# EAGLE design tester (EAGLE 9.3.0)
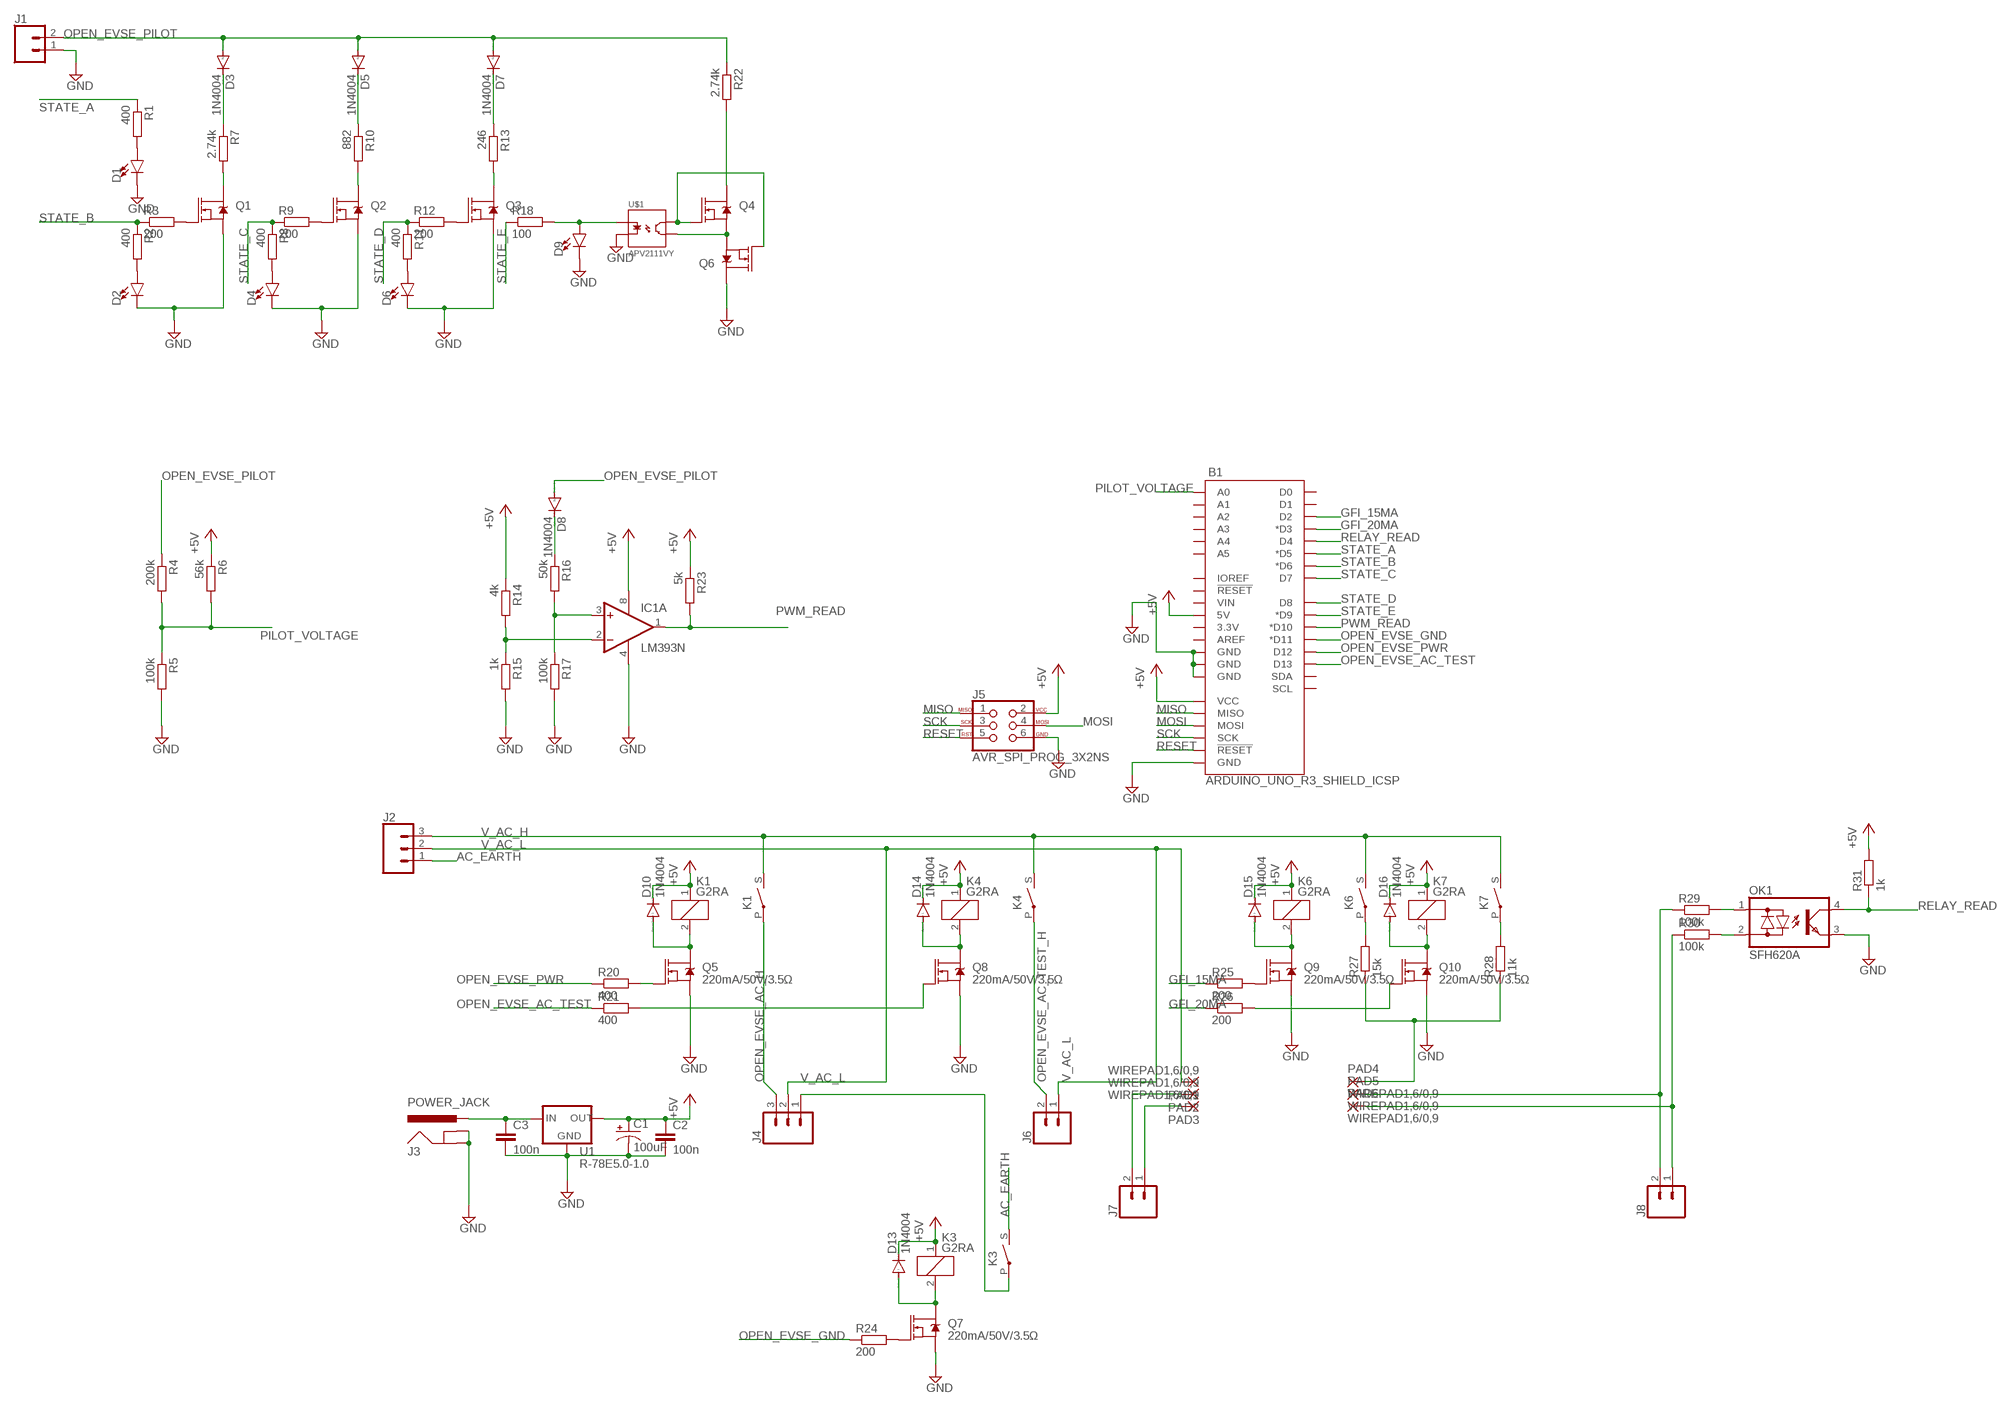
[diagram p0: schematic, sheet 1]

## Parts
B1  ARDUINO_UNO_R3_SHIELD_ICSP  [UNO_R3_SHIELD_ICSP]
C1  100uF  100UF-POLAR-RADIAL-2.5MM-25V-20%  [CPOL-RADIAL-2.5MM-6.5MM]
C2  100n  C-EU025-024X044  [C025-024X044]
C3  100n  C-EU025-024X044  [C025-024X044]
D1  LED-FKIT-1206  [FKIT-LED-1206]
D2  LED-FKIT-1206  [FKIT-LED-1206]
D3  1N4004  [DO41-10]
D4  LED-FKIT-1206  [FKIT-LED-1206]
D5  1N4004  [DO41-10]
D6  LED-FKIT-1206  [FKIT-LED-1206]
D7  1N4004  [DO41-10]
D8  1N4004  [DO41-10]
D9  LED-FKIT-1206  [FKIT-LED-1206]
D10  1N4004  [DO41-10]
D13  1N4004  [DO41-10]
D14  1N4004  [DO41-10]
D15  1N4004  [DO41-10]
D16  1N4004  [DO41-10]
IC1  LM393N  [DIL08]
J1  CONN_023.5MM  [SCREWTERMINAL-3.5MM-2]
J2  CONN_03-SCREW-5MM  [SCREWTERMINAL-5MM-3]
J3  POWER_JACK  [POWER_JACK_PTH]
J4  CONN_03-SCREW-5MM  [SCREWTERMINAL-5MM-3]
J5  AVR_SPI_PROG_3X2NS  [2X3-NS]
J6  CONN_023.5MM  [SCREWTERMINAL-3.5MM-2]
J7  CONN_023.5MM  [SCREWTERMINAL-3.5MM-2]
J8  CONN_023.5MM  [SCREWTERMINAL-3.5MM-2]
K1  G2RA  [G2RA]
K3  G2RA  [G2RA]
K4  G2RA  [G2RA]
K6  G2RA  [G2RA]
K7  G2RA  [G2RA]
OK1  SFH620A  [DIL04]
PAD1  WIREPAD1,6/0,9  [1,6/0,9]
PAD2  WIREPAD1,6/0,9  [1,6/0,9]
PAD3  WIREPAD1,6/0,9  [1,6/0,9]
PAD4  WIREPAD1,6/0,9  [1,6/0,9]
PAD5  WIREPAD1,6/0,9  [1,6/0,9]
PAD6  WIREPAD1,6/0,9  [1,6/0,9]
Q1  220mA/50V/3.5Ω  MOSFET-NCH-BSS138  [SOT23-3]
Q2  220mA/50V/3.5Ω  MOSFET-NCH-BSS138  [SOT23-3]
Q3  220mA/50V/3.5Ω  MOSFET-NCH-BSS138  [SOT23-3]
Q4  220mA/50V/3.5Ω  MOSFET-NCH-BSS138  [SOT23-3]
Q5  220mA/50V/3.5Ω  MOSFET-NCH-BSS138  [SOT23-3]
Q6  220mA/50V/3.5Ω  MOSFET-NCH-BSS138  [SOT23-3]
Q7  220mA/50V/3.5Ω  MOSFET-NCH-BSS138  [SOT23-3]
Q8  220mA/50V/3.5Ω  MOSFET-NCH-BSS138  [SOT23-3]
Q9  220mA/50V/3.5Ω  MOSFET-NCH-BSS138  [SOT23-3]
Q10  220mA/50V/3.5Ω  MOSFET-NCH-BSS138  [SOT23-3]
R1  400  R-EU_R1206  [R1206]
R2  400  R-EU_R1206  [R1206]
R3  200  R-EU_R1206  [R1206]
R4  200k  R-EU_R1206  [R1206]
R5  100k  R-EU_R1206  [R1206]
R6  56k  R-EU_R1206  [R1206]
R7  2.74k  R-EU_R1206  [R1206]
R8  400  R-EU_R1206  [R1206]
R9  200  R-EU_R1206  [R1206]
R10  882  R-EU_R1206  [R1206]
R11  400  R-EU_R1206  [R1206]
R12  200  R-EU_R1206  [R1206]
R13  246  R-EU_R1206  [R1206]
R14  4k  R-EU_R1206  [R1206]
R15  1k  R-EU_R1206  [R1206]
R16  50k  R-EU_R1206  [R1206]
R17  100k  R-EU_R1206  [R1206]
R18  100  R-EU_R1206  [R1206]
R20  400  R-EU_R1206  [R1206]
R21  400  R-EU_R1206  [R1206]
R22  2.74k  R-EU_R1206  [R1206]
R23  5k  R-EU_R1206  [R1206]
R24  200  R-EU_R1206  [R1206]
R25  200  R-EU_R1206  [R1206]
R26  200  R-EU_R1206  [R1206]
R27  15k  R-EU_0204/5  [0204/5]
R28  11k  R-EU_0204/5  [0204/5]
R29  100k  R-EU_0204/5  [0204/5]
R30  100k  R-EU_0204/5  [0204/5]
R31  1k  R-EU_R1206  [R1206]
U1  R-78E5.0-1.0  [DC-DC_CONVERTER_78XX]
U$1  APV2111VY  [SSOP4]

## Nets
+5V: B1.5V B1.5V_ICSP(VCC) C1.1(+) C2.1 D10.C D13.C D14.C D15.C D16.C IC1.8(P:V+) J5.2 K1.1 K3.1 K4.1 K6.1 K7.1 R6.1 R14.1 R23.1 R31.2 U1.VOUT(OUT)
AC_EARTH [230v]: J2.1 K3.S(2:S)
GFI_15MA: B1.D2 R25.1
GFI_20MA: B1.D3(*D3) R26.1
GND: B1.GND@0(GND) B1.GND@1(GND) B1.GND@2(GND) B1.GND_ICSP(GND) C1.2(-) C2.2 C3.2 D1.C D2.C D4.C D6.C D9.C IC1.4(P:V-) J1.1 J3.GND J3.GNDBREAK J5.6 OK1.3(E) Q1.2(S) Q2.2(S) Q3.2(S) Q5.2(S) Q6.3(D) Q7.2(S) Q8.2(S) Q9.2(S) Q10.2(S) R5.2 R15.2 R17.2 U1.GND U$1.2(C1)
MISO: B1.MISO J5.1
MOSI: B1.MOSI J5.4
N$1: Q1.1(G) R3.2
N$2: D2.A R2.2
N$3: D3.C R7.1
N$4: Q2.1(G) R9.2
N$5: D6.A R11.2
N$6: Q3.1(G) R12.2
N$7: D7.C R13.1
N$8: Q3.3(D) R13.2
N$9 [230v]: J7.1 PAD3.1(P)
N$10: IC1.2(A:-IN) R14.2 R15.1
N$11: Q1.3(D) R7.2
N$12: IC1.3(A:+IN) R16.2 R17.1
N$13: D8.C R16.1
N$14: Q4.2(S) Q6.2(S) U$1.4(EM1)
N$15 [230v]: J7.2 PAD2.1(P)
N$16: Q4.3(D) R22.2
N$17 [230v]: J4.1 K3.P(2:P)
N$18 [230v]: J8.2 PAD5.1(P) R29.1
N$19 [230v]: J8.1 PAD6.1(P) R30.1
N$20 [230v]: OK1.1(AC1) R29.2
N$21 [230v]: OK1.2(AC2) R30.2
N$22: C3.1 J3.PWR U1.VIN(IN)
N$23: D15.A K6.2 Q9.3(D)
N$24: D4.A R8.2
N$25: D16.A K7.2 Q10.3(D)
N$26: K7.P(2:P) R28.2
N$27: Q8.1(G) R21.2
N$28 [230v]: K6.P(2:P) R27.2
N$29 [230v]: PAD4.1(P) R27.1 R28.1
N$30: D14.A K4.2 Q8.3(D)
N$31: Q2.3(D) R10.2
N$32: D10.A K1.2 Q5.3(D)
N$33: Q5.1(G) R20.2
N$34: D5.C R10.1
N$35: Q9.1(G) R25.2
N$36: Q10.1(G) R26.2
N$37: D1.A R1.2
N$38: D9.A R18.2 U$1.1(A1)
N$39: Q7.1(G) R24.2
N$40: D13.A K3.2 Q7.3(D)
N$43: Q4.1(G) Q6.1(G) U$1.3(CL1)
OPEN_EVSE_AC_H [230v]: J4.3 K1.P(2:P)
OPEN_EVSE_AC_TEST: B1.D13 R21.1
OPEN_EVSE_AC_TEST_H [230v]: J6.2 K4.P(2:P)
OPEN_EVSE_GND: B1.D11(*D11) R24.1
OPEN_EVSE_PILOT: D3.A D5.A D7.A D8.A J1.2 R4.1 R22.1
OPEN_EVSE_PWR: B1.D12 R20.1
PILOT_VOLTAGE: B1.A0 R4.2 R5.1 R6.2
PWM_READ: B1.D10(*D10) IC1.1(A:OUT) R23.2
RELAY_READ: B1.D4 OK1.4(C) R31.1
RESET: B1.RST_ICSP(!RESET!) J5.5
SCK: B1.SCK J5.3
STATE_A: B1.D5(*D5) R1.1
STATE_B: B1.D6(*D6) R2.1 R3.1
STATE_C: B1.D7 R8.1 R9.1
STATE_D: B1.D8 R11.1 R12.1
STATE_E: B1.D9(*D9) R18.1
V_AC_H [230v]: J2.3 K1.S(2:S) K4.S(2:S) K6.S(2:S) K7.S(2:S)
V_AC_L [230v]: J2.2 J4.2 J6.1 PAD1.1(P)
Unconnected: B1.3.3V B1.A1 B1.A2 B1.A3 B1.A4 B1.A5 B1.AREF B1.IOREF B1.RES(!RESET!) B1.RX(D0) B1.SCL B1.SDA B1.TX(D1) B1.VIN IC1.5(B:+IN) IC1.6(B:-IN) IC1.7(B:OUT)

## Library data of the parts
B1 = SparkFun-Boards:ARDUINO_UNO_R3_SHIELD_ICSP: Arduino R3 Shield Footprint with ICSP Header Includes pins for 6-pin (2x3) ICSP Header. Compatible with Leonardo boards that require SPI pin connections via this header. SparkFun Products: CryptoShield <https://www.sparkfun.com/products/13183> microSD Shield <https://www.sparkfun.com/products/12761> R3 Stackable Headers Kit <https://www.sparkfun.com/products/1417>
C1 = SparkFun-Capacitors:100UF-POLAR: 100µF polarized capacitors A capacitor is a passive two-terminal electrical component used to store electrical energy temporarily in an electric field.; PROD_ID: CAP-08439
C2 C3 = rcl:C-EU: CAPACITOR, European symbol; SPICEPREFIX: C
D1 D2 D4 D6 D9 = SparkFun-LED:LED: LED (Generic) Standard schematic elements and footprints for 5mm, 3mm, 1206, and 0603 sized LEDs. Generic LEDs with no color specified.
D3 D5 D7 D8 D10 D13-D16 = diode:1N4004: DIODE general purpose rectifier, 1 A
IC1 = linear:LM393: COMPARATOR
J1 J6-J8 = SparkFun-Connectors:CONN_02: Multi connection point. Often used as Generic Header-pin footprint for 0.1 inch spaced/style header connections On any of the 0.1 inch spaced packages, you can populate with these: Break Away Headers - Straight <https://www.sparkfun.com/products/116> (PRT-00116) Break Away Male Headers - Right Angle <https://www.sparkfun.com/products/553> (PRT-00553) Female Headers <https://www.sparkfun.com/products/115> (PRT-00115) Break Away Headers - Machine Pin <https://www.sparkfun.com/products/117> (PRT-00117) Break Away Female Headers - Swiss Machine Pin <https://www.sparkfun.com/products/743> (PRT-00743) For SCREWTERMINALS and SPRING TERMINALS visit here: Screw Terimnals on SparkFun.com <https://www.sparkfun.com/search/results?term=Screw+Terminals> (5mm/3.5mm/2.54mm spacing) This device is also useful as a general connection point to wire up your design to another part of your project. Our various solder wires solder well into these plated through hole pads. Hook-Up Wire - Assortment (Stranded, 22 AWG) <https://www.sparkfun.com/products/11375> (PRT-11375) Hook-Up Wire - Assortment (Solid Core, 22 AWG) <https://www.sparkfun.com/products/11367> (PRT-11367) View the entire wire category on our website here <https://www.sparkfun.com/categories/141> Special notes: Molex polarized connector foot print use with: PRT-08233 with associated crimp pins and housings. 2.54_SCREWTERM for use with PRT-10571. 3.5mm Screw Terminal footprints for PRT-08084 5mm Screw Terminal footprints for use with PRT-08432; PROD_ID: CONN-08399
J2 J4 = SparkFun-Connectors:CONN_03: Multi connection point. Often used as Generic Header-pin footprint for 0.1 inch spaced/style header connections On any of the 0.1 inch spaced packages, you can populate with these: Break Away Headers - Straight <https://www.sparkfun.com/products/116> (PRT-00116) Break Away Male Headers - Right Angle <https://www.sparkfun.com/products/553> (PRT-00553) Female Headers <https://www.sparkfun.com/products/115> (PRT-00115) Break Away Headers - Machine Pin <https://www.sparkfun.com/products/117> (PRT-00117) Break Away Female Headers - Swiss Machine Pin <https://www.sparkfun.com/products/743> (PRT-00743) Stackable Header - 3 Pin (Female, 0.1") <https://www.sparkfun.com/products/13875> (PRT-13875) For SCREWTERMINALS and SPRING TERMINALS visit here: Screw Terimnals on SparkFun.com <https://www.sparkfun.com/search/results?term=Screw+Terminals> (5mm/3.5mm/2.54mm spacing) This device is also useful as a general connection point to wire up your design to another part of your project. Our various solder wires solder well into these plated through hole pads. Hook-Up Wire - Assortment (Stranded, 22 AWG) <https://www.sparkfun.com/products/11375> (PRT-11375) Hook-Up Wire - Assortment (Solid Core, 22 AWG) <https://www.sparkfun.com/products/11367> (PRT-11367) View the entire wire category on our website here <https://www.sparkfun.com/categories/141> Special notes: Molex polarized connector foot print use with SKU : PRT-08232 with associated crimp pins and housings.; PROD_ID: CONN-10134; SF_SKU: PRT-08433
J3 = SparkFun-Connectors:POWER_JACK: Power Jack Connector This is the standard 5.5mm barrel jack for power. The PTH is the most common, proven, reliable, footprint. The Slot footprint only works if the mill layer is transmitted to the PCB fab house so be warned. Here are the connectors we sell at SparkFun: DC Barrel Power Jack/Connector <https://www.sparkfun.com/products/119> (PRT-00119) DC Barrel Power Jack/Connector (SMD) <https://www.sparkfun.com/products/12748> (PRT-12748) DC Barrel Jack Adapter - Breadboard Compatible <https://www.sparkfun.com/products/10811> (PRT-10811) It is used on this SparkFun product (and many, many others): SparkFun RedBoard - Programmed with Arduino <https://www.sparkfun.com/products/12757> (DEV-12757) Also, if you need a mating power supply or connector, please check these out: Wall Adapter Power Supply - 9VDC 650mA <https://www.sparkfun.com/products/298> (TOL-00298) DC Barrel Jack Adapter - Male <https://www.sparkfun.com/products/10287> (PRT-10287); PROD_ID: CONN-08197
J5 = SparkFun-Connectors:AVR_SPI_PROG_3X2: AVR ISP 6 Pin This is the reduced ISP connector for AVR programming. Common on Arduino. This footprint will take up less PCB space and can be used with a 10-pin to 6-pin adapter such as SKU: BOB-08508 **Special note about "TEST_POINT" package. The stop mask is on the top side, so if you want your programming test points to be on the bottom of your board, make sure to place this package on the bottom side of the board. This also ensure that the orientation to program from the bottom side will be correct. SparkFun Products: SparkFun ISP Pogo Adapter <https://www.sparkfun.com/products/11591> - NS Tiny AVR Programmer <https://www.sparkfun.com/products/11801> -PTH
K1 K3 K4 K6 K7 = relay:G2RA: RELAY 1 x norm. open, Omron; OC_FARNELL: unknown; OC_NEWARK: unknown
OK1 = optocoupler:SFH620: Optocoupler, Phototransistor Output, AC Input Source: http://www.vishay.com/docs/83675/sfh620.pdf; MPN: SFH620A-2; OC_FARNELL: 1469594; OC_NEWARK: 97K9546
PAD1-PAD6 = wirepad:WIREPAD: Wire PAD connect wire on PCB
Q1-Q10 = SparkFun-DiscreteSemi:MOSFET-NCH: N-channel MOSFETs Voltage controlled devices that allow control of high current outputs. SparkFun Products: SparkFun OpenScale <https://www.sparkfun.com/products/13261> SparkFun Digital Sandbox <https://www.sparkfun.com/products/12651> SparkFun Monster Moto Shield <https://www.sparkfun.com/products/10182> SparkFun MOSFET Power Controller <https://www.sparkfun.com/products/11214>; PROD_ID: TRANS-00830
R1-R18 R20-R31 = rcl:R-EU_: RESISTOR, European symbol; SPICEPREFIX: R
U1 = SparkFun-IC-Power:R-78E5.0-1.0: Recom Power 5V 1A DC/DC Converter The Recom R-78E5.0-X.X is a compact DC/DC converter module that is a pin for pin drop-in replacement for the LM7805 linear voltage regulator. Specifications: Input Range: 7-28V Output Voltage: 5V Output Current: 1A Max Efficiency: 91% Datasheet <https://www.recom-power.com/pdf/Innoline/R-78Exx-1.0.pdf>; PROD_ID: COM-13655
U$1 = parts:APV2111VY

## Net classes
0 default: width 0.254 mm, drill 0.305 mm, clearance 0.203 mm
1 230v: width 0.61 mm, drill 0.711 mm, clearance 0.813 mm

## Board
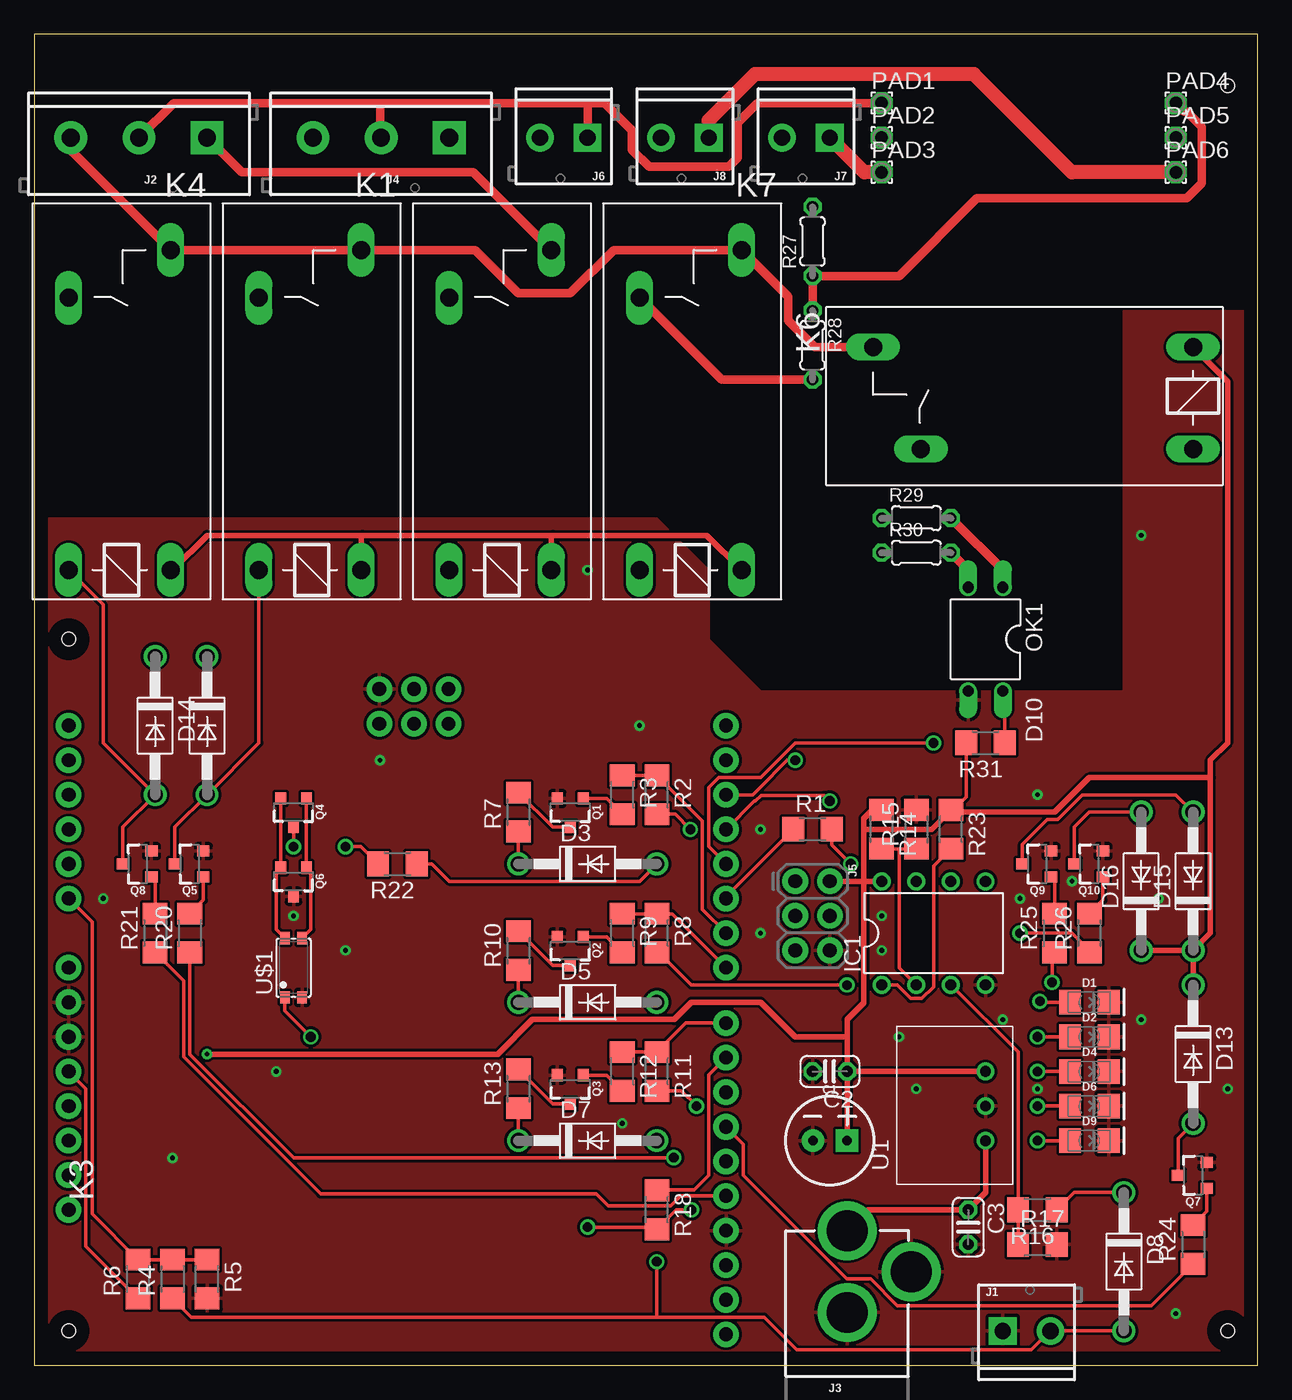
[diagram p1: board, top side]
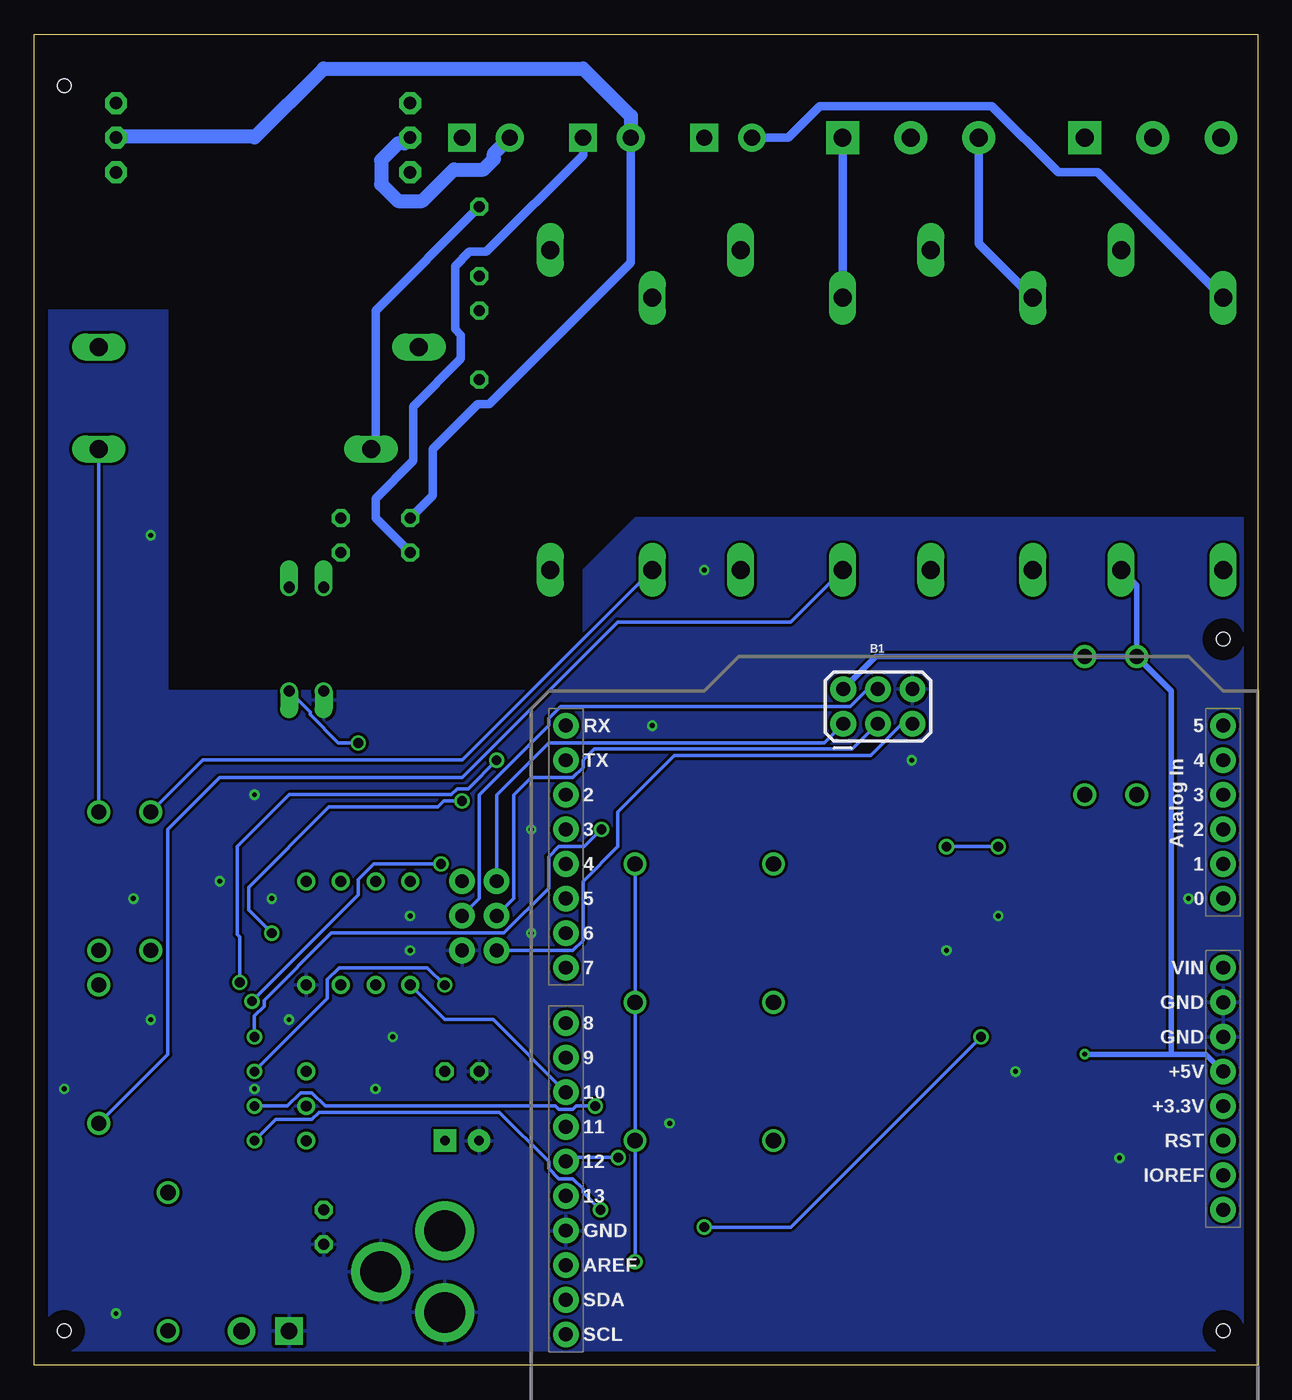
[diagram p2: board, bottom side, seen from below]

Size 89.84 x 97.78 mm. Coordinates in mm from the lower left corner, seen from the top.
Outline: 0,0 89.84,0 89.84,97.78 0,97.78 0,0
Copper layers (1*16): Top 0.035mm / dielectric 1.5mm / Bottom 0.035mm
Design rules "default": minimum track width 6mil, minimum drill 0.35mm, track to track 6mil, track to pad 6mil, pad to pad 6mil, via to via 6mil, smd to smd 6mil, copper to edge 40mil, drill to drill 6mil, minimum pad ring 10mil, minimum via ring 8mil, stop-mask expansion 4mil, vias tented up to drill 0mil, thermal gap 10mil
Holes 1 mm at 87.63,93.98 87.63,2.54 2.54,2.54 2.54,53.34

### Footprints (pad centres in the part's own frame; a part is rotated, then mirrored left to right if it is on the bottom)
UNO_R3_SHIELD_ICSP = drill 1.016 pad 1.88: 3.3V 24.13,-3.81; 5V 24.13,-1.27; 5V_ICSP -3.76,26.81; A0 24.13,11.43; A1 24.13,13.97; A2 24.13,16.51; A3 24.13,19.05; A4 24.13,21.59; A5 24.13,24.13; AREF -24.13,-15.494; D2 -24.13,19.05; D3 -24.13,16.51; D4 -24.13,13.97; D5 -24.13,11.43; D6 -24.13,8.89; D7 -24.13,6.35; D8 -24.13,2.286; D9 -24.13,-0.254; D10 -24.13,-2.794; D11 -24.13,-5.334; D12 -24.13,-7.874; D13 -24.13,-10.414; GND@0 24.13,1.27; GND@1 24.13,3.81; GND@2 -24.13,-12.954; GND_ICSP 1.32,26.81; IOREF 24.13,-8.89; MISO -3.76,24.27; MOSI -1.22,26.81; NC 24.13,-11.43; RES 24.13,-6.35; RST_ICSP 1.32,24.27; RX -24.13,24.13; SCK -1.22,24.27; SCL -24.13,-20.574; SDA -24.13,-18.034; TX -24.13,21.59; VIN 24.13,6.35
CPOL-RADIAL-2.5MM-6.5MM = drill 0.7 pad 1.651 square: 1 1.25,0 | drill 0.7 pad 1.651: 2 -1.25,0
C025-024X044 = drill 0.813 octagon: 1 -1.27,0; 2 1.27,0
FKIT-LED-1206 = smd 1.6 x 1.803: A -1.422,0; C 1.422,0
DO41-10 = drill 1.118: A 5.08,0; C -5.08,0
DIL08 = drill 0.813 pad 1.27: 1 -3.81,-3.81; 2 -1.27,-3.81; 3 1.27,-3.81; 4 3.81,-3.81; 5 3.81,3.81; 6 1.27,3.81; 7 -1.27,3.81; 8 -3.81,3.81
SCREWTERMINAL-3.5MM-2 = drill 1.2 pad 2.032 square: 1 0,0 | drill 1.2 pad 2.032: 2 3.5,0
SCREWTERMINAL-5MM-3 = drill 1.3 pad 2.413 square: 1 0,0 | drill 1.3 pad 2.413: 2 5,0; 3 10,0
POWER_JACK_PTH = drill 2.997 pad 4.318: GND 0,7.7; GNDBREAK 4.7,10.7; PWR 0,13.7
2X3-NS = drill 1.016 pad 1.88: 1 -2.54,-1.27; 2 -2.54,1.27; 3 0,-1.27; 4 0,1.27; 5 2.54,-1.27; 6 2.54,1.27
G2RA = drill 1.321 long: 1 -3.81,-3.683; 2 -3.81,3.81; P 16.18,3.81; S 19.685,-3.683
DIL04 = drill 0.813 offset: 1 -1.27,-3.81; 2 1.27,-3.81; 3 1.27,3.81; 4 -1.27,3.81
1,6/0,9 = drill 0.914 pad 1.6 octagon: 1 0,0
SOT23-3 = smd 0.8 x 0.9: 1 -0.95,-1; 2 0.95,-1; 3 0,1.1
R1206 = smd 1.6 x 1.803: 1 -1.422,0; 2 1.422,0
0204/5 = drill 0.813 octagon: 1 -2.54,0; 2 2.54,0
DC-DC_CONVERTER_78XX = drill 0.8: GND 0,0; VIN -2.54,0; VOUT 2.54,0
SSOP4 = smd 0.9 x 0.7: 1 -2.175,0.635; 2 -2.175,-0.635; 3 2.175,-0.635; 4 2.175,0.635

### Placement (x,y rotation side)
B1  26.67,22.86 0 bottom
C1  58.42,16.51 0 top
C2  58.42,21.59 180 top
C3  68.58,10.16 270 top
D1  77.47,26.67 0 top
D2  77.47,24.13 0 top
D3  40.64,36.83 0 top
D4  77.47,21.59 0 top
D5  40.64,26.67 0 top
D6  77.47,19.05 0 top
D7  40.64,16.51 0 top
D8  80.01,7.62 270 top
D9  77.47,16.51 0 top
D10  12.7,46.99 270 top
D13  85.09,22.86 270 top
D14  8.89,46.99 270 top
D15  85.09,35.56 90 top
D16  81.28,35.56 90 top
IC1  66.04,31.75 0 top
J1  71.12,2.54 0 top
J2  12.7,90.17 180 top
J3  59.69,-3.81 0 top
J4  30.48,90.17 180 top
J5  57.15,33.02 270 top
J6  40.64,90.17 180 top
J7  58.42,90.17 180 top
J8  49.53,90.17 180 top
K1  20.32,62.23 90 top
K3  34.29,62.23 90 top
K4  6.35,62.23 90 top
K6  81.28,71.12 180 top
K7  48.26,62.23 90 top
OK1  69.85,53.34 180 top
PAD1  62.23,92.71 0 top
PAD2  62.23,90.17 0 top
PAD3  62.23,87.63 0 top
PAD4  83.82,92.71 0 top
PAD5  83.82,90.17 0 top
PAD6  83.82,87.63 0 top
Q1  39.37,40.64 180 top
Q2  39.37,30.48 180 top
Q3  39.37,20.32 180 top
Q4  19.05,40.64 180 top
Q5  11.43,36.83 90 top
Q6  19.05,35.56 180 top
Q7  85.09,13.97 90 top
Q8  7.62,36.83 90 top
Q9  73.66,36.83 90 top
Q10  77.47,36.83 90 top
R1  57.15,39.37 0 top
R2  45.72,41.91 270 top
R3  43.18,41.91 270 top
R4  10.16,6.35 90 top
R5  12.7,6.35 270 top
R6  7.62,6.35 90 top
R7  35.56,40.64 90 top
R8  45.72,31.75 270 top
R9  43.18,31.75 270 top
R10  35.56,30.48 90 top
R11  45.72,21.59 270 top
R12  43.18,21.59 270 top
R13  35.56,20.32 90 top
R14  62.23,39.37 270 top
R15  64.77,39.37 90 top
R16  73.66,11.43 180 top
R17  73.66,8.89 0 top
R18  45.72,11.43 270 top
R20  11.43,31.75 90 top
R21  8.89,31.75 90 top
R22  26.67,36.83 180 top
R23  67.31,39.37 270 top
R24  85.09,8.89 90 top
R25  74.93,31.75 90 top
R26  77.47,31.75 90 top
R27  57.15,82.55 90 top
R28  57.15,74.93 270 top
R29  64.77,62.23 0 top
R30  64.77,59.69 0 top
R31  69.85,45.72 180 top
U1  69.85,19.05 90 top
U$1  19.05,29.21 90 top

### Tracks (layer width: path | path; a pad name or v marks a point on that pad's centre or on a via)
+5V  (via drill 0.35)
  Top 0.254: B1.5V 3.81,20.32 3.81,8.74 R6.1 | R31.2 68.43,41.76 67.31,40.64
  Top 0.406: K6.1 87.63,72.26 87.63,45.72 86.36,44.45 86.36,43.18 | v12.7,22.86 34.04,22.86 36.58,25.4 46.99,25.4 48.26,26.67 53.34,26.67 55.88,24.13 59.72,24.13 | K4.1 10.16,58.42 12.7,60.96 24.13,60.96 | D15.C D13.C | D15.C D16.C | D15.C 86.36,31.75 86.36,43.18 | 86.36,43.18 77.47,43.18 74.93,40.64 67.31,40.64 R23.1 65.89,39.37 60.92,39.37 | C2.1 59.72,21.61 59.72,24.13 | C2.1 59.69,16.53 C1.1 | C2.1 U1.VOUT | R14.1 61.53,40.79 60.92,40.19 60.92,39.37 | 60.92,39.37 60.92,35.56 | 60.92,35.56 60.92,26.63 59.69,25.4 59.69,24.16 59.72,24.13 | IC1.8 60.92,35.56 | 60.92,35.56 J5.2 | 24.13,60.96 38.1,60.96 | 38.1,60.96 49.4,60.96 K7.1 | K3.1 37.97,60.83 38.1,60.96 | K1.1 24,60.83 24.13,60.96
  Bottom 0.406: v12.7,22.86 6.35,22.86 | 6.35,22.86 3.81,22.86 B1.5V | B1.5V_ICSP 28.03,52.07 D10.C D14.C | D14.C 8.89,57.28 K4.1 | D14.C 6.35,49.53 6.35,22.86
AC_EARTH
  Top 0.61: J2.1 15.24,87.63 32.26,87.63 K3.S
GFI_15MA  (via drill 0.71)
  Top 0.254: B1.D2 52.77,41.91 53.05,42.2 53.2,42.35 55.3,44.45 v55.88,44.45 | v74.73,28.14 74.73,30.13 R25.1
  Bottom 0.254: v74.73,28.14 74.73,31.47 74.93,31.66 74.93,38.1 71.11,41.92 59.22,41.92 58.79,42.35 57.98,42.35 v55.88,44.45
GFI_20MA  (via drill 0.71)
  Top 0.254: B1.D3 52.88,41.45 52.95,41.45 53.38,41.87 58.01,41.87 v58.42,41.46 | v72.39,31.75 76.2,31.75 77.47,30.48 R26.1
  Bottom 0.254: v58.42,41.46 59.76,41.46 60.2,41.02 68.2,41.02 74.1,35.12 74.1,33.46 v72.39,31.75
GND  (via drill 0.35)
  other vias: 44.45,46.99 17.78,21.59 10.16,15.24 25.4,44.45 22.86,30.48 5.08,34.29 43.18,17.78 64.77,20.32 63.5,24.13 71.12,25.4 81.28,25.4 82.55,34.29 73.66,41.91 76.2,35.56 87.63,20.32 73.66,20.32 83.82,3.81 81.28,60.96 40.64,58.42 53.34,31.75 19.05,33.02 72.39,34.29 53.34,39.37 62.23,33.02 62.23,30.48
  pour Bottom: -2.54,62.23 45.72,62.23 49.53,58.42 49.53,53.34 53.34,49.53 80.01,49.53 80.01,77.47 91.44,77.47 91.44,-2.54 -2.54,-2.54
  pour Top: -2.54,62.23 45.72,62.23 49.53,58.42 49.53,53.34 53.34,49.53 80.01,49.53 80.01,77.47 91.44,77.47 91.44,-2.54 -2.54,-2.54
MISO
  Bottom 0.254: J5.1 55.88,41.91 52.07,45.72 31.84,45.72 B1.MISO
MOSI
  Bottom 0.254: J5.4 57.15,34.29 57.15,41.91 52.07,46.99 52.07,47.52 51.19,48.4 29.9,48.4 28.63,49.67 B1.MOSI
N$1
  Top 0.254: R3.2 42.03,41.64 Q1.1
N$2  (via drill 0.71)
  Top 0.254: R2.2 47.07,40.49 v48.18,39.37 | v73.66,24.13 D2.A
  Bottom 0.254: v48.18,39.37 49.45,38.1 51.33,38.1 52.07,37.36 52.07,35.03 55.35,31.75 68,31.75 72.95,26.8 72.95,26.38 73.66,25.67 v73.66,24.13
N$3
  Top 0.254: R7.1 D3.C
N$4
  Top 0.254: R9.2 42.03,31.48 Q2.1
N$5  (via drill 0.71)
  Top 0.254: R11.2 47.52,20.17 v48.64,19.05 | v73.66,19.05 D6.A
  Bottom 0.254: v48.64,19.05 50.02,19.05 50.27,18.8 51.33,18.8 51.58,19.05 68.46,19.05 69.44,20.03 70.26,20.03 71.24,19.05 v73.66,19.05
N$6
  Top 0.254: R12.2 42.03,21.32 Q3.1
N$7
  Top 0.254: D7.C R13.1
N$8
  Top 0.254: Q3.3 38.08,19.22 R13.2
N$9
  Top 1.016: PAD3.1 60.96,87.63 J7.1
N$10
  Top 0.254: R14.2 63.5,37.95 | 63.5,37.95 R15.1 | IC1.2 63.5,29.21 63.5,37.95
N$11
  Top 0.254: R7.2 38.08,39.54 Q1.3
N$12
  Top 0.254: IC1.3 72.24,23.01 R16.2 R17.1
N$13
  Top 0.254: R16.1 76.35,12.7 D8.C
N$14
  Top 0.254: U$1.4 17.78,32.02 17.78,36.24 Q6.2 Q4.2
N$15
  Bottom 1.016: J7.2 56.08,89.01 56.08,88.61 56.86,87.83 59.03,87.83 61.35,85.51 63.11,85.51 64.35,86.75 64.35,88.51 63.11,89.75 62.65,89.75 PAD2.1
N$16  (via drill 0.71)
  Top 0.254: Q4.3 v19.05,38.1 | v22.86,38.1 23.98,38.1 R22.2
  Bottom 0.254: v19.05,38.1 v22.86,38.1
N$17
  Bottom 0.61: J4.1 K3.P
N$18
  Bottom 0.61: R29.1 60.58,63.88 60.58,67.31 57.28,70.61 56.41,70.61 46.03,81 J8.2
  Bottom 1.016: J8.2 46.03,91.75 49.53,95.25 68.58,95.25 73.66,90.17 73.72,90.23 83.76,90.23 PAD5.1
N$19
  Top 1.016: J8.1 49.53,91.44 52.92,94.83 69,94.83 76.2,87.63 PAD6.1
  Bottom 0.61: J8.1 49.53,88.9 56.64,81.79 57.89,81.79 58.93,80.75 58.93,76.11 58.5,75.68 58.5,73.93 62,70.42 62,66.44 64.77,63.67 64.77,62.23 R30.1
N$20
  Top 0.61: R29.2 69.29,60.25 69.32,60.25 71.12,58.45 OK1.1
N$21
  Top 0.61: R30.2 68.58,58.42 OK1.2
N$22
  Top 0.406: J3.PWR 61.23,11.43 C3.1 69.85,12.7 U1.VIN
N$23
  Top 0.254: Q9.3 72.56,38.27 74.4,40.11 75.15,40.11 76.95,41.91 83.82,41.91 D15.A
  Bottom 0.254: D15.A K6.2
N$24  (via drill 0.71)
  Top 0.254: R8.2 45.87,30.33 48.26,27.94 v59.69,27.94 | v73.66,21.59 D4.A
  Bottom 0.254: v59.69,27.94 60.96,29.21 67.44,29.21 68.3,28.35 68.3,26.95 v73.66,21.59
N$25
  Top 0.254: Q10.3 76.37,39.54 77.47,40.64 D16.A
  Bottom 0.254: K7.2 58.42,44.45 77.47,44.45 D16.A
N$26
  Top 0.61: K7.P 50.47,72.39 R28.2
N$27
  Top 0.254: R21.2 8.89,35.61 Q8.1
N$28
  Bottom 0.61: K6.P 64.77,67.64 64.77,77.47 R27.2
N$29
  Top 0.61: R28.1 R27.1 63.5,80.01 69.2,85.71 84.61,85.71 85.74,86.84 85.74,90.96 84.61,92.09 84.44,92.09 PAD4.1
N$30
  Top 0.254: K4.2 5.08,55.88 5.08,45.72 D14.A 6.52,39.54 Q8.3
N$31
  Top 0.254: R10.2 38.08,29.38 Q2.3
N$32
  Top 0.254: Q5.3 10.33,39.54 D10.A 16.51,45.72 K1.2
N$33
  Top 0.254: R20.2 12.43,34.17 Q5.1
N$34
  Top 0.254: R10.1 D5.C
N$35
  Top 0.254: Q9.1 74.93,35.61 R25.2
N$36
  Top 0.254: R26.2 78.47,34.17 Q10.1
N$37  (via drill 0.71)
  Top 0.254: D1.A 73.92,26.67 v73.84,26.75 | v59.96,36.83 58.57,38.22 R1.2
  Bottom 0.254: v73.84,26.75 66.04,34.55 66.04,35.69 64.9,36.83 v59.96,36.83
N$38  (via drill 0.71)
  Top 0.254: v48.26,11.43 47.14,11.43 R18.2 45.57,10.16 v40.64,10.16 | v73.66,16.51 D9.A | v20.32,24.13 18.41,26.04 U$1.1
  Bottom 0.254: v48.26,11.43 49.53,12.7 49.53,12.97 50.27,13.72 51.33,13.72 52.07,14.46 52.07,14.99 55.68,18.59 68.92,18.59 69.44,18.07 72.1,18.07 v73.66,16.51 | v40.64,10.16 34.29,10.16 v20.32,24.13
N$39
  Top 0.254: Q7.1 86.09,11.31 R24.2
N$40
  Top 0.254: Q7.3 83.99,16.68 D13.A
  Bottom 0.254: K3.2 34.29,54.61 46.99,54.61 58.42,43.18 76.2,43.18 80.01,39.37 80.01,22.86 D13.A
N$43
  Top 0.254: U$1.3 20.32,32.02 20.32,36.24 Q6.1 Q4.1
OPEN_EVSE_AC_H
  Bottom 0.61: K1.P 20.48,82.38 J4.3
OPEN_EVSE_AC_TEST
  Top 0.254: R21.1 10.97,28.25 10.97,22.67 21.05,12.6 41.27,12.6 42.14,11.72 46.76,11.72 47.48,12.45 B1.D13
OPEN_EVSE_AC_TEST_H
  Bottom 0.61: K4.P 11.76,87.63 14.65,87.63 19.52,92.49 32.15,92.49 34.47,90.17 J6.2
OPEN_EVSE_GND
  Top 0.254: R24.1 82.02,4.4 63.36,4.4 61.41,6.35 60.75,6.35 60.72,6.38 59.66,6.38 52.07,13.97 52.07,16.26 B1.D11
OPEN_EVSE_PILOT  (via drill 0.71)
  Top 0.254: D8.A J1.2 73.22,1.14 56.01,1.14 53.59,3.56 45.72,3.56 | 45.72,3.56 11.53,3.56 R4.1 | v45.72,7.62 45.72,3.56 | R22.1 29.21,36.83 30.48,35.56 44.45,35.56 D3.A
  Bottom 0.254: v45.72,7.62 D7.A D5.A D3.A
OPEN_EVSE_PWR  (via drill 0.71)
  Top 0.254: R20.1 11.43,22.86 19.05,15.24 46.92,15.24 v46.96,15.27
  Bottom 0.254: v46.96,15.27 50.51,15.27 B1.D12
PILOT_VOLTAGE
  Top 0.254: B1.A0 4.27,32.56 4.27,11.12 R6.2 R4.2 R5.1
PWM_READ
  Top 0.254: R23.2 66.04,36.68 66.04,27.81 65.18,26.95 64.36,26.95 63.37,27.94 IC1.1
  Bottom 0.254: IC1.1 59.69,25.4 56.13,25.4 B1.D10
RELAY_READ  (via drill 0.71)
  Top 0.254: B1.D4 49.53,38.1 49.53,42.44 50.27,43.18 53.35,43.18 55.89,45.72 v66.04,45.72 | OK1.4 71.27,49.38 R31.1
  Bottom 0.254: OK1.4 69.57,47.98 69.57,47.8 67.49,45.72 v66.04,45.72
RESET
  Bottom 0.254: J5.5 50.27,30.48 49.53,31.22 49.53,35.56 46.99,38.1 46.99,40.64 42.82,44.81 28.42,44.81 26.09,47.13 B1.RST_ICSP
SCK
  Bottom 0.254: J5.3 54.61,34.29 54.61,41.91 53.34,43.18 50.27,43.18 49.53,43.92 49.53,44.45 48.72,45.26 29.76,45.26 B1.SCK
STATE_A
  Top 0.254: R1.1 50.8,34.44 B1.D5
STATE_B
  Top 0.254: R3.1 R2.1 49.07,39.98 49.07,33.48 B1.D6
STATE_C
  Top 0.254: R9.1 R8.1 46.84,33.17 B1.D7
STATE_D
  Top 0.254: B1.D8 47.85,25.15 R11.1 R12.1
STATE_E
  Top 0.254: B1.D9 49.53,21.34 49.53,13.97 48.46,12.9 45.77,12.9 R18.1
V_AC_H
  Top 0.61: J2.3 2.7,89.25 K4.S K1.S 32.38,81.92 35.56,78.74 39.37,78.74 42.55,81.92 K7.S 55.37,78.49 55.37,76.73 57.3,74.8 K6.S
V_AC_L
  Top 0.61: J2.2 10.24,92.71 25.4,92.71 | 25.4,92.71 40.64,92.71 | 40.64,92.71 41.91,92.71 43.9,90.72 43.9,89.29 45.15,88.04 51.01,88.04 51.66,88.69 51.66,91.28 53.1,92.71 PAD1.1 | J4.2 25.4,90.25 25.4,92.71 | J6.1 40.64,92.71